# EAGLE design orienteering_clock_rev2 (EAGLE 7.3.0)
REVISION: v2.1
Assembly variants: power-LM7805, power-POLOLU, SA40-19SRWA
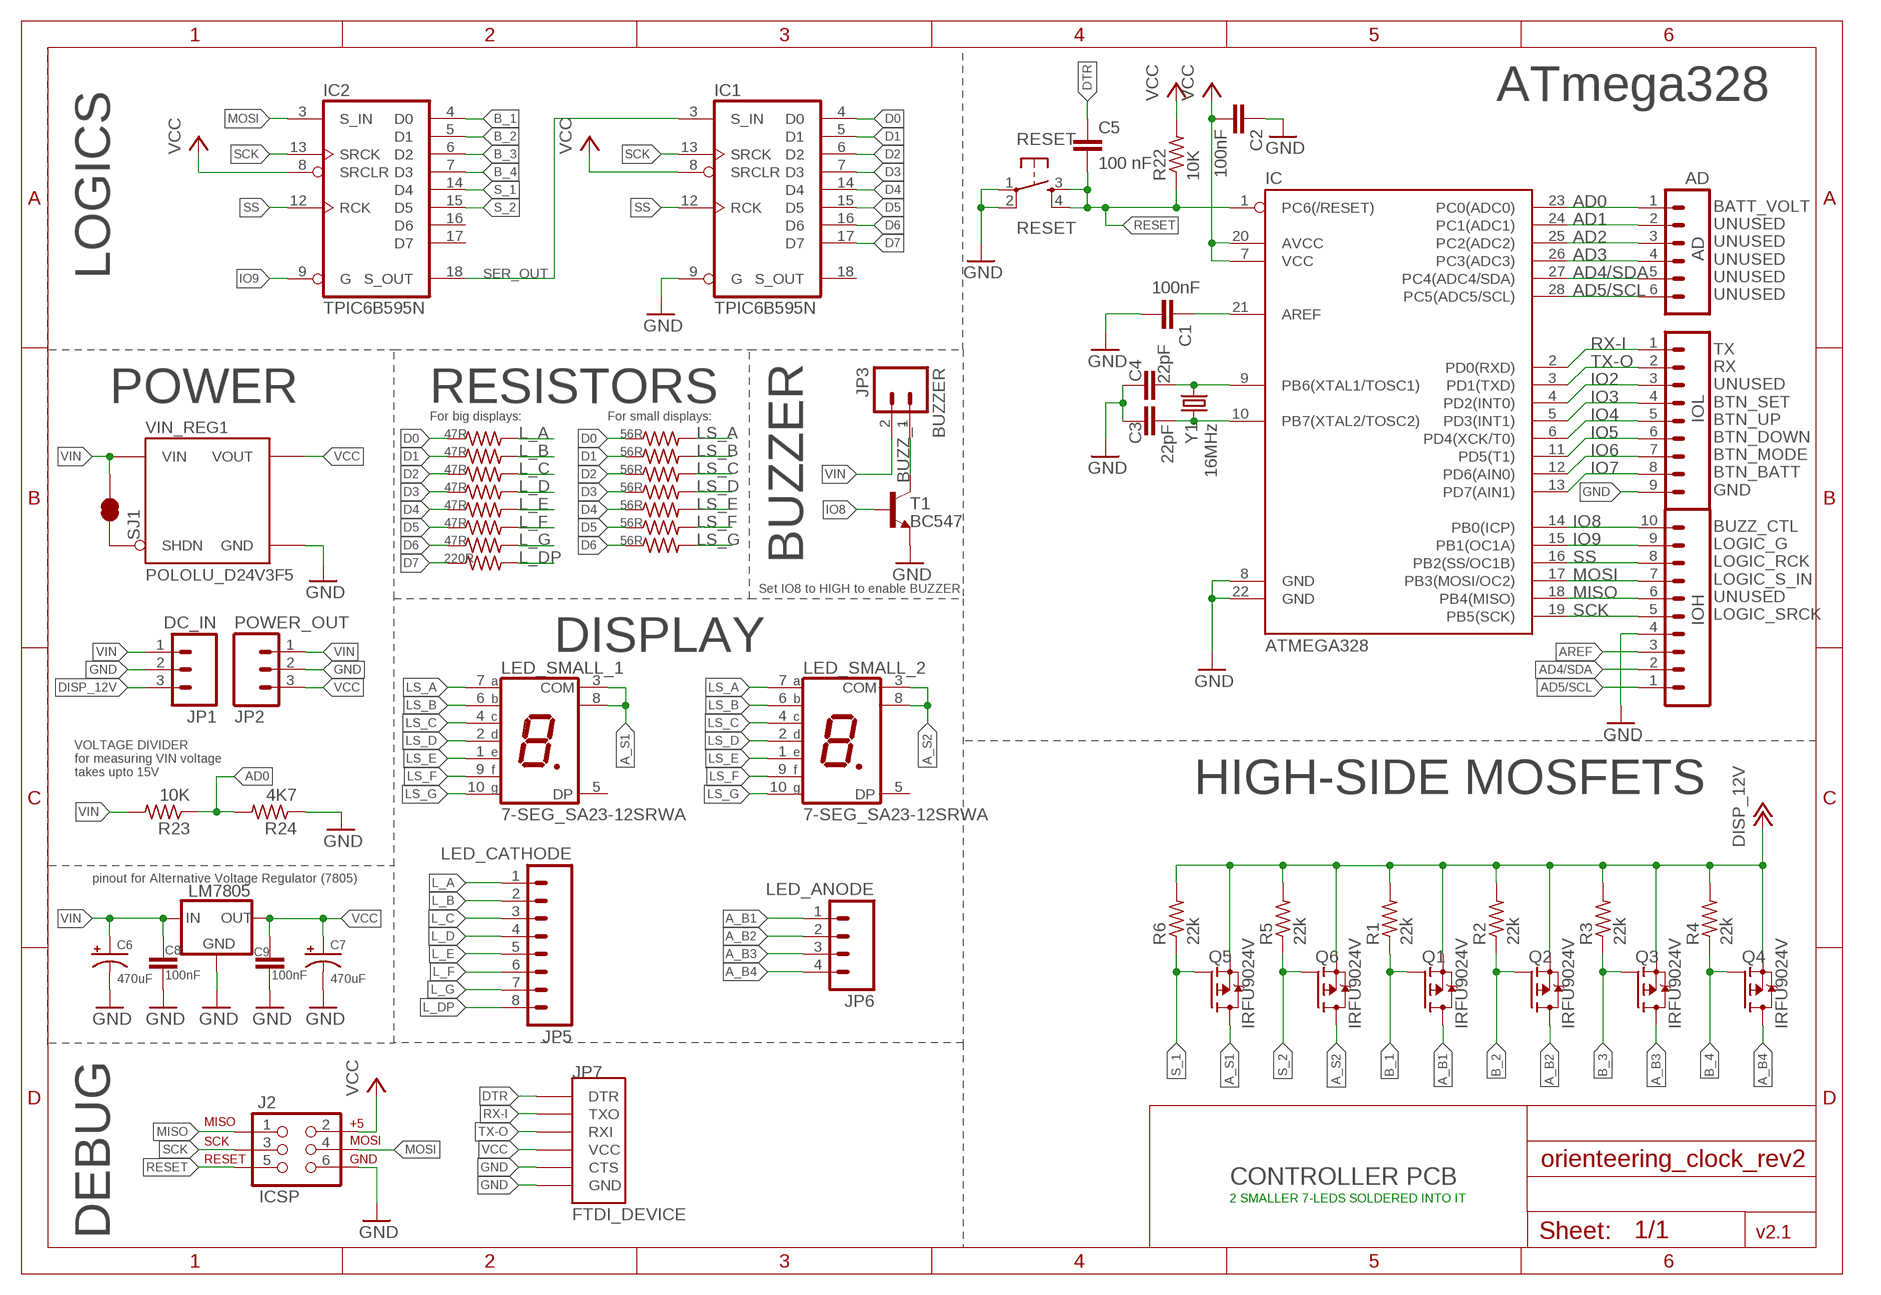
[diagram p0: schematic, sheet 1]

## Parts
AD  AD  M06SIP_LOCK  [1X06-SIP_LOCK]
C1  100nF  CAPPTH  [CAP-PTH-SMALL]
C2  100nF  CAPPTH  [CAP-PTH-SMALL]
C3  22pF  CAPPTH  [CAP-PTH-SMALL]
C4  22pF  CAPPTH  [CAP-PTH-SMALL]
C5  100 nF  CAPPTH  [CAP-PTH-SMALL]
C6  470uF  CAP_POLPTH1  [CPOL-RADIAL-100UF-25V]  (not fitted in variant power-POLOLU)  (not fitted in variant SA40-19SRWA)
C7  470uF  CAP_POLPTH1  [CPOL-RADIAL-100UF-25V]  (not fitted in variant power-POLOLU)  (not fitted in variant SA40-19SRWA)
C8  100nF  CAPPTH  [CAP-PTH-SMALL]  (not fitted in variant power-POLOLU)  (not fitted in variant SA40-19SRWA)
C9  100nF  CAPPTH  [CAP-PTH-SMALL]  (not fitted in variant power-POLOLU)  (not fitted in variant SA40-19SRWA)
IC  ATMEGA328  ATMEGA328P_PDIP  [DIL28-3]
IC1  TPIC6B595N  [DIL20]
IC2  TPIC6B595N  [DIL20]
IOH  M10LOCK  [1X10_LOCK]
IOL  M09LOCK  [1X09_LOCK]
J2  ICSP  AVR_SPI_PRG_62X3_LOCK  [2X3_LOCK]
JP1  DC_IN  M03POLAR  [MOLEX-1X3]
JP2  POWER_OUT  M03LOCK  [1X03_LOCK]
JP3  BUZZER  M02LOCK  [1X02_LOCK]
JP5  LED_CATHODE  M08  [1X08_ROUND]
JP6  LED_ANODE  M04PTH  [1X04]
JP7  FTDI_DEVICE  [FTDI_DEVICE_SIDE]
LED_SMALL_1  7-SEG_SA23-12SRWA  [SA23-12SRWA]
LED_SMALL_2  7-SEG_SA23-12SRWA  [SA23-12SRWA]
LM7805  78XXS  [78XXS]  (not fitted in variant power-POLOLU)  (not fitted in variant SA40-19SRWA)
Q1  IRFU9024V  [TO251AA-V]
Q2  IRFU9024V  [TO251AA-V]
Q3  IRFU9024V  [TO251AA-V]
Q4  IRFU9024V  [TO251AA-V]
Q5  IRFU9024V  [TO251AA-V]
Q6  IRFU9024V  [TO251AA-V]
R1  22k  R-US_0207/5V  [0207/5V]
R2  22k  R-US_0207/5V  [0207/5V]
R3  22k  R-US_0207/5V  [0207/5V]
R4  22k  R-US_0207/5V  [0207/5V]
R5  22k  R-US_0207/5V  [0207/5V]
R6  22k  R-US_0207/5V  [0207/5V]
R7  47R  R-US_0207/10  [0207/10]  (variant SA40-19SRWA: 22R/1W)
R8  47R  R-US_0207/10  [0207/10]  (variant SA40-19SRWA: 22R/1W)
R9  47R  R-US_0207/10  [0207/10]  (variant SA40-19SRWA: 22R/1W)
R10  47R  R-US_0207/10  [0207/10]  (variant SA40-19SRWA: 22R/1W)
R11  47R  R-US_0207/10  [0207/10]  (variant SA40-19SRWA: 22R/1W)
R12  47R  R-US_0207/10  [0207/10]  (variant SA40-19SRWA: 22R/1W)
R13  47R  R-US_0207/10  [0207/10]  (variant SA40-19SRWA: 22R/1W)
R14  56R  R-US_0207/10  [0207/10]
R15  56R  R-US_0207/10  [0207/10]
R16  56R  R-US_0207/10  [0207/10]
R17  56R  R-US_0207/10  [0207/10]
R18  56R  R-US_0207/10  [0207/10]
R19  56R  R-US_0207/10  [0207/10]
R20  56R  R-US_0207/10  [0207/10]
R21  220R  R-US_0207/10  [0207/10]
R22  10K  R-US_0207/10  [0207/10]
R23  10K  R-US_0207/10  [0207/10]
R24  4K7  R-US_0207/10  [0207/10]
RESET  RESET  TAC_SWITCHPTH  [TACTILE-PTH]
SJ1  SHDN_PULLUP  JUMPER-PAD-2-NC_BY_TRACE  [PAD-JUMPER-2-NC_BY_TRACE_YES_SILK]  (not fitted in variant power-LM7805)
T1  BC547  [TO92]
VIN_REG1  POLOLU_D24V3F5  POLOLU_D24V3F5-HC  [POLOLU_D24V3F_HC]  (not fitted in variant power-LM7805)
Y1  16MHz  CRYSTALHC49US  [HC49US]

## Nets
A_B1 [power]: JP6.1 Q1.2(D)
A_B2 [power]: JP6.2 Q2.2(D)
A_B3 [power]: JP6.3 Q3.2(D)
A_B4 [power]: JP6.4 Q4.2(D)
A_S1 [power]: LED_SMALL_1.3(COM) LED_SMALL_1.8(COM) Q5.2(D)
A_S2 [power]: LED_SMALL_2.3(COM) LED_SMALL_2.8(COM) Q6.2(D)
AD0 [SPI]: AD.1 IC.23(PC0(ADC0)) R23.1 R24.2
AD1 [SPI]: AD.2 IC.24(PC1(ADC1))
AD2 [SPI]: AD.3 IC.25(PC2(ADC2))
AD3 [SPI]: AD.4 IC.26(PC3(ADC3))
AD4/SDA [SPI]: AD.5 IC.27(PC4(ADC4/SDA)) IOH.2
AD5/SCL [SPI]: AD.6 IC.28(PC5(ADC5/SCL)) IOH.1
AREF [SPI]: C1.1 IC.21(AREF) IOH.3
B_1: IC2.4(D0) Q1.1(G) R1.1
B_2: IC2.5(D1) Q2.1(G) R2.1
B_3: IC2.6(D2) Q3.1(G) R3.1
B_4: IC2.7(D3) Q4.1(G) R4.1
BUZZ_- [SPI]: JP3.1 T1.3(C)
D0: IC1.4(D0) R7.1 R14.1
D1: IC1.5(D1) R8.1 R15.1
D2: IC1.6(D2) R9.1 R16.1
D3: IC1.7(D3) R10.1 R17.1
D4: IC1.14(D4) R11.1 R18.1
D5: IC1.15(D5) R12.1 R19.1
D6: IC1.16(D6) R13.1 R20.1
D7: IC1.17(D7) R21.1
DISP_12V [power]: JP1.3 Q1.3(S) Q2.3(S) Q3.3(S) Q4.3(S) Q5.3(S) Q6.3(S) R1.2 R2.2 R3.2 R4.2 R5.2 R6.2
DTR: C5.1 JP7.P$1(DTR)
GND [GND]: C1.2 C2.1 C3.1 C4.1 C6.2(-) C7.2(-) C8.2 C9.2 IC1.9(G) IC.8(GND) IC.22(GND) IOH.4 IOL.9 J2.6 JP1.2 JP2.2 JP7.P$5(CTS) JP7.P$6(GND) LM7805.GND R24.1 RESET.1 RESET.2 T1.1(E) VIN_REG1.G(GND)
IO2: IC.4(PD2(INT0)) IOL.3
IO3: IC.5(PD3(INT1)) IOL.4
IO4: IC.6(PD4(XCK/T0)) IOL.5
IO5: IC.11(PD5(T1)) IOL.6
IO6: IC.12(PD6(AIN0)) IOL.7
IO7: IC.13(PD7(AIN1)) IOL.8
IO8: IC.14(PB0(ICP)) IOH.10 T1.2(B)
IO9: IC2.9(G) IC.15(PB1(OC1A)) IOH.9
L_A: JP5.1 R7.2
L_B: JP5.2 R8.2
L_C: JP5.3 R9.2
L_D: JP5.4 R10.2
L_DP: JP5.8 R21.2
L_E: JP5.5 R11.2
L_F: JP5.6 R12.2
L_G: JP5.7 R13.2
LS_A: LED_SMALL_1.7(A) LED_SMALL_2.7(A) R14.2
LS_B: LED_SMALL_1.6(B) LED_SMALL_2.6(B) R15.2
LS_C: LED_SMALL_1.4(C) LED_SMALL_2.4(C) R16.2
LS_D: LED_SMALL_1.2(D) LED_SMALL_2.2(D) R17.2
LS_E: LED_SMALL_1.1(E) LED_SMALL_2.1(E) R18.2
LS_F: LED_SMALL_1.9(F) LED_SMALL_2.9(F) R19.2
LS_G: LED_SMALL_1.10(G) LED_SMALL_2.10(G) R20.2
MISO [SPI]: IC.18(PB4(MISO)) IOH.6 J2.1
MOSI [SPI]: IC2.3(S_IN) IC.17(PB3(MOSI/OC2)) IOH.7 J2.4
N$1 [SPI]: SJ1.2 VIN_REG1.S(SHDN)
N$5: C4.2 IC.9(PB6(XTAL1/TOSC1)) Y1.2
N$6: C3.2 IC.10(PB7(XTAL2/TOSC2)) Y1.1
RESET: C5.2 IC.1(PC6(/RESET)) J2.5 R22.1 RESET.3 RESET.4
RX-I: IC.2(PD0(RXD)) IOL.1 JP7.P$2(TXO)
S_1: IC2.14(D4) Q5.1(G) R6.1
S_2: IC2.15(D5) Q6.1(G) R5.1
SCK [SPI]: IC1.13(SRCK) IC2.13(SRCK) IC.19(PB5(SCK)) IOH.5 J2.3
SER_OUT: IC1.3(S_IN) IC2.18(S_OUT)
SS: IC1.12(RCK) IC2.12(RCK) IC.16(PB2(SS/OC1B)) IOH.8
TX-O: IC.3(PD1(TXD)) IOL.2 JP7.P$3(RXI)
VCC [SPI]: C2.2 C7.1(+) C9.1 IC1.8(SRCLR) IC2.8(SRCLR) IC.7(VCC) IC.20(AVCC) J2.2 JP2.3 JP7.P$4(VCC) LM7805.OUT R22.2 VIN_REG1.O(VOUT)
VIN [power]: C6.1(+) C8.1 JP1.1 JP2.1 JP3.2 LM7805.IN R23.2 SJ1.1 VIN_REG1.I(VIN)
Unconnected: IC1.18(S_OUT) IC2.16(D6) IC2.17(D7) LED_SMALL_1.5(DP) LED_SMALL_2.5(DP)

## Notes on the sheet
- ATmega328
- LOGICS
- BATT_VOLT
  UNUSED
  UNUSED
  UNUSED
  UNUSED
  UNUSED
- POWER | RESISTORS
- For big displays: | For small displays:
- TX
  RX
  UNUSED
  BTN_SET
  BTN_UP
  BTN_DOWN
  BTN_MODE
  BTN_BATT
  GND
- BUZZER
- Set IO8 to HIGH to enable BUZZER
- BUZZ_CTL
  LOGIC_G
  LOGIC_RCK
  LOGIC_S_IN
  UNUSED
  LOGIC_SRCK
- DISPLAY
- VOLTAGE DIVIDER
  for measuring VIN voltage
  takes upto 15V
- HIGH-SIDE MOSFETS
- pinout for Alternative Voltage Regulator (7805)
- CONTROLLER PCB
- 2 SMALLER 7-LEDS SOLDERED INTO IT
- DEBUG

## Power pins joined to a net without a drawn wire
GND: IC1.10(GND) IC1.11(GND) IC1.19(GND) IC2.10(GND) IC2.11(GND) IC2.19(GND)
VCC: IC1.2(VCC) IC2.2(VCC)

## Library data of the parts
AD = SparkFun:M06: Header 6 Standard 6-pin 0.1" header. Use with straight break away headers (SKU : PRT-00116), right angle break away headers (PRT-00553), swiss pins (PRT-00743), machine pins (PRT-00117), and female headers (PRT-00115). Molex polarized connector foot print use with SKU : PRT-08094 with associated crimp pins and housings. NOTES ON THE VARIANTS LOCK and LOCK_LONGPADS... This footprint was designed to help hold the alignment of a through-hole component (i.e. 6-pin header) while soldering it into place. You may notice that each hole has been shifted either up or down by 0.005 of an inch from it's more standard position (which is a perfectly straight line). This slight alteration caused the pins (the squares in the middle) to touch the edges of the holes. Because they are alternating, it causes a "brace" to hold the component in place. 0.005 has proven to be the perfect amount of "off-center" position when using our standard breakaway headers. Although looks a little odd when you look at the bare footprint, once you have a header in there, the alteration is very hard to notice. Also, if you push a header all the way into place, it is covered up entirely on the bottom side. This idea of altering the position of holes to aid alignment will be further integrated into the Sparkfun Library for other footprints. It can help hold any component with 3 or more connection pins.
C1 C2 C5 = SparkFun:CAP: Capacitor Standard 0603 ceramic capacitor, and 0.1" leaded capacitor.
C3 C4 = SparkFun-Capacitors:CAP: Capacitor Standard 0603 ceramic capacitor, and 0.1" leaded capacitor.
C6 C7 = SparkFun-Passives:CAP_POL: Capacitor Polarized These are standard SMD and PTH capacitors. Normally 10uF, 47uF, and 100uF in electrolytic and tantalum varieties. Always verify the external diameter of the through hole cap, it varies with capacity, voltage, and manufacturer. The EIA devices should be standard.
C8 C9 = SparkFun-Passives:CAP: Capacitor Standard 0603 ceramic capacitor, and 0.1" leaded capacitor.
IC = SparkFun-DigitalIC:ATMEGA328P_PDIP: uC used in the Arduino 32kb flash, 1k EEPROM, 2k SRAM This is the through-hole version of this chip.
IC1 IC2 = NumericDisplay:TPIC6B595: 8-bit SHIFT REGISTER, output latch
IOH = SparkFun-Connectors:M10: Header 10 Standard 10-pin 0.1" header. Use with straight break away headers (SKU : PRT-00116), right angle break away headers (PRT-00553), swiss pins (PRT-00743), machine pins (PRT-00117), and female headers (PRT-00115).
IOL = SparkFun-Connectors:M09: Header 9 Standard 9-pin 0.1" header. Use with straight break away headers (SKU : PRT-00116), right angle break away headers (PRT-00553), swiss pins (PRT-00743), machine pins (PRT-00117), and female headers (PRT-00115).
J2 = SparkFun-Connectors:AVR_SPI_PRG_6: AVR ISP 6 Pin This is the reduced ISP connector for AVR programming. Common on Arduino. This footprint will take up less PCB space and can be used with a 10-pin to 6-pin adapter such as SKU: BOB-08508 **Special note about "TEST_POINT" package. The stop mask is on the top side, so if you want your programming test points to be on the bottom of your board, make sure to place this package on the bottom side of the board. This also ensure that the orientation to program from the bottom side will be correct.
JP1 JP2 = SparkFun-Connectors:M03: Header 3 Standard 3-pin 0.1" header. Use with straight break away headers (SKU : PRT-00116), right angle break away headers (PRT-00553), swiss pins (PRT-00743), machine pins (PRT-00117), and female headers (PRT-00115). Molex polarized connector foot print use with SKU : PRT-08232 with associated crimp pins and housings.
JP3 = SparkFun-Connectors:M02: Standard 2-pin 0.1" header. Use with - straight break away headers ( PRT-00116) - right angle break away headers (PRT-00553) - swiss pins (PRT-00743) - machine pins (PRT-00117) - female headers (PRT-00115) Molex polarized connector foot print use with: PRT-08233 with associated crimp pins and housings. 2.54_SCREWTERM for use with PRT-10571. 3.5mm Screw Terminal footprints for PRT-08084 5mm Screw Terminal footprints for use with PRT-08432
JP5 = SparkFun-Connectors:M08: Header 8 Standard 8-pin 0.1" header. Use with straight break away headers (SKU : PRT-00116), right angle break away headers (PRT-00553), swiss pins (PRT-00743), machine pins (PRT-00117), and female headers (PRT-00115).
JP6 = SparkFun-Connectors:M04: Header 4 Standard 4-pin 0.1" header. Use with straight break away headers (SKU : PRT-00116), right angle break away headers (PRT-00553), swiss pins (PRT-00743), machine pins (PRT-00117), and female headers (PRT-00115). Molex polarized connector foot print use with SKU : PRT-08231 with associated crimp pins and housings. 1MM SMD Version SKU: PRT-10208
JP7 = SparkFun-Connectors:FTDI_DEVICE: Connector which mates to FTDI basic or FTDI cable.
LED_SMALL_1 LED_SMALL_2 = MINE:7-SEG_: Kingbright 14.2mm (0.56 INCH) SINGLE DIGIT NUMERIC DUISPLAY Source: SA56-11EWA(Ver1189471036.pdf
LM7805 = MINE:78XXS: VOLTAGE REGULATOR - NO DRILL
Q1-Q6 = MINE:IRFU9024: P-CHANNEL MOSFET
R1-R24 = resistor:R-US_: RESISTOR, American symbol
RESET = SparkFun:TAC_SWITCH: Momentary Switch Button commonly used for reset or general input. Spark Fun Electronics SKU : COM-00097
SJ1 = SparkFun-Passives:JUMPER-PAD-2-NC_BY_TRACE
T1 = transistor:BC547: NPN TRANSISTOR
VIN_REG1 = _hhn_Pololu:POLOLU_D24V3F*: Pololu Step Down Voltage Regulators Series D24V3F_ (300 mA) 0.4"x0.5" SOURCE www.pololu.com/ PACKAGE THT; 4-pin (0.1"); 0.4"x0.5" TECHNOLOGIES D24V3F… Vo/V Vi/V (for max. Io) X: (generic) 3: 3.3 3.8 ( 4.3) … 42.0 5: 5.0 6.0 ( 6.5) … 42.0 9: 9.0 10.5 (12.5) … 42.0 12: 12.0 14.0 (17.5) … 42.0 Io: 300 mA; Quiescent Current: 2 mA (SHDN: 20 uA) Author: Dipl.-Ing. FH Rainer Bayer
Y1 = SparkFun-FreqCtrl:CRYSTAL: Various standard crystals. Proven footprints.

## Net classes
0 default: width 0.305 mm, drill 0.305 mm, clearance 0.305 mm
1 power: width 0.813 mm, drill 0.61 mm, clearance 0.406 mm
2 GND: width 0.813 mm, drill 0.61 mm, clearance 0.406 mm
3 SPI: width 0.406 mm, clearance 0.305 mm

## Board
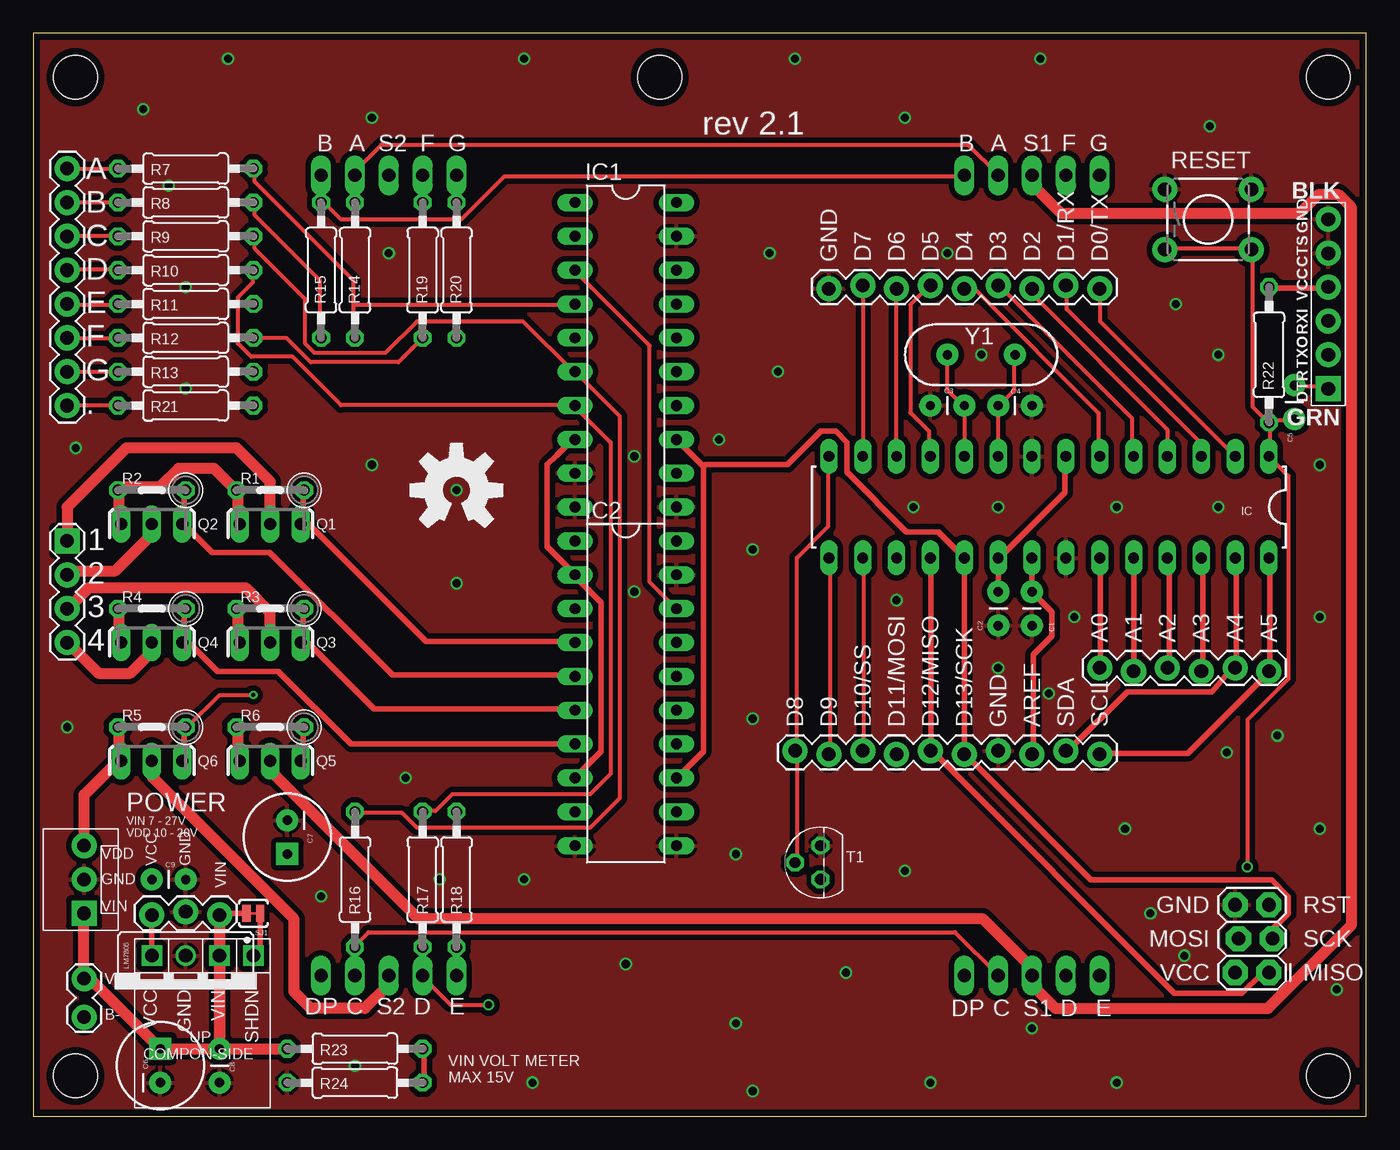
[diagram p1: board, top side]
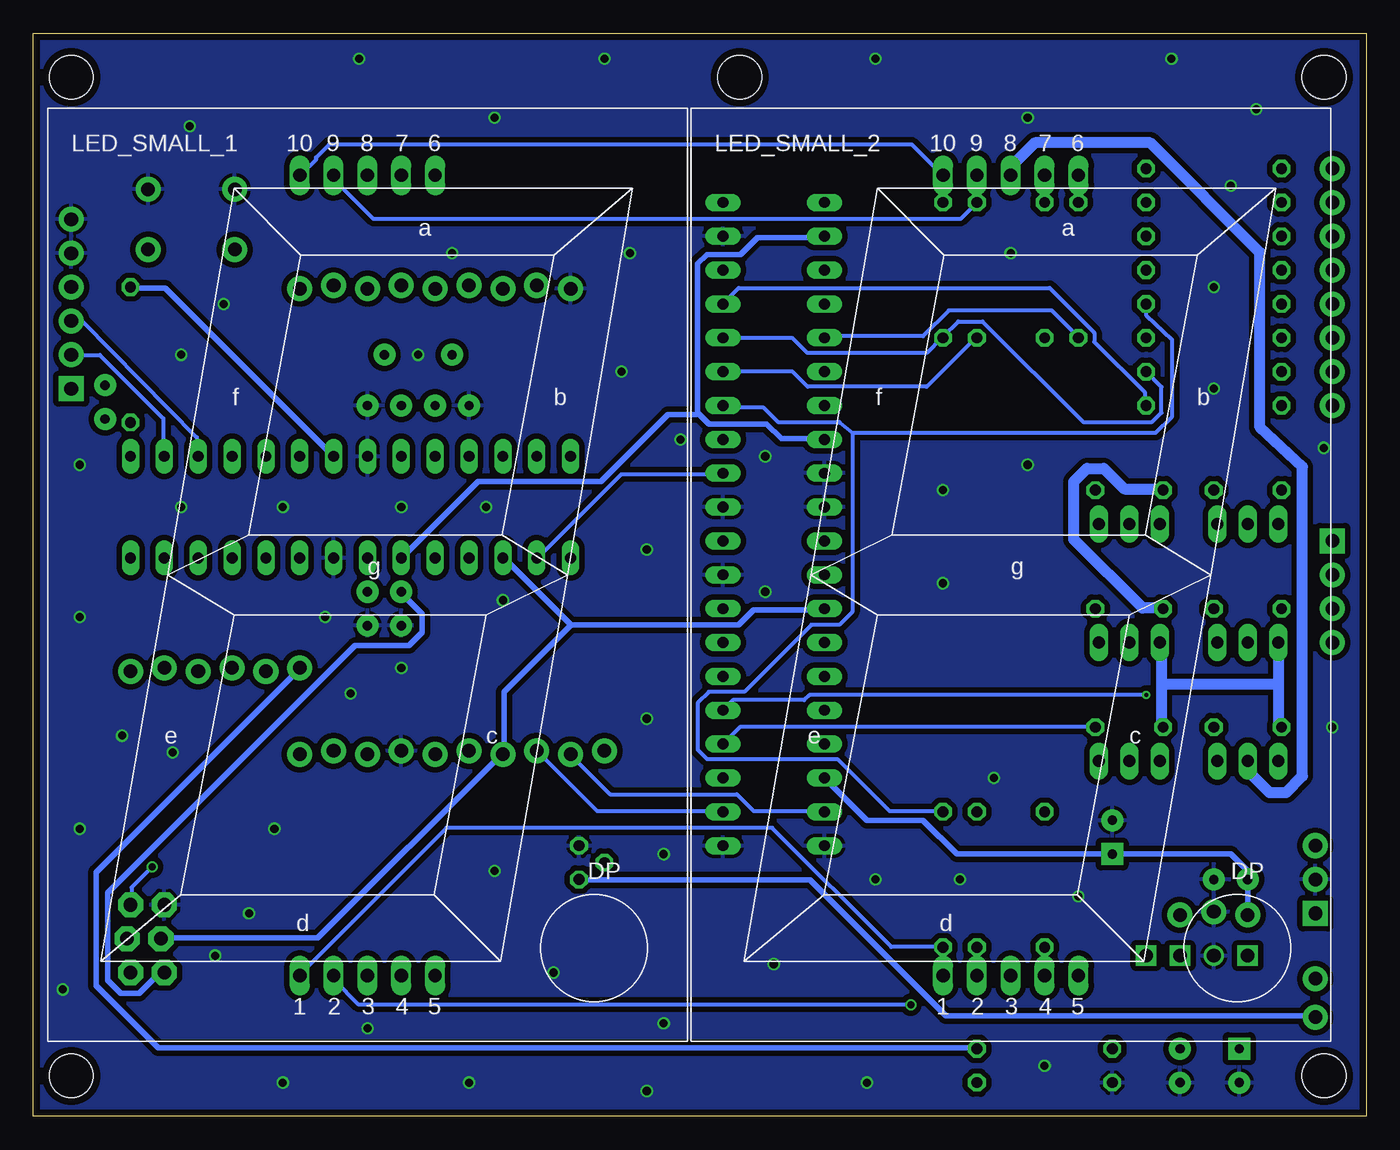
[diagram p2: board, bottom side, seen from below]

Size 100 x 81.27 mm. Coordinates in mm from the lower left corner, seen from the top.
Outline: 0,0 100,0 100,81.27 0,81.27 0,0
Copper layers (1*16): Top 0.035mm / dielectric 1.5mm / Bottom 0.035mm
Design rules "smart-prototyping_EagleRules": minimum track width 7mil, minimum drill 12mil, track to track 7mil, track to pad 7mil, pad to pad 7mil, via to via 7mil, smd to smd 0mil, copper to edge 20mil, drill to drill 10mil, minimum pad ring 10mil, minimum via ring 6mil, stop-mask expansion 2mil, vias tented up to drill 25mil, thermal gap 10mil

### Footprints (pad centres in the part's own frame; a part is rotated, then mirrored left to right if it is on the bottom)
1X06-SIP_LOCK = drill 1.016 pad 1.88: 1 0,0; 2 2.54,-0.254; 3 5.08,0; 4 7.62,-0.254; 5 10.16,0; 6 12.7,-0.254
CAP-PTH-SMALL = drill 0.7 pad 1.651: 1 0,0; 2 2.54,0
CPOL-RADIAL-100UF-25V = drill 0.7 pad 1.651 square: 1 1.27,0 | drill 0.7 pad 1.651: 2 -1.27,0
DIL28-3 = drill 0.813 long: 1 -16.51,-3.81; 2 -13.97,-3.81; 3 -11.43,-3.81; 4 -8.89,-3.81; 5 -6.35,-3.81; 6 -3.81,-3.81; 7 -1.27,-3.81; 8 1.27,-3.81; 9 3.81,-3.81; 10 6.35,-3.81; 11 8.89,-3.81; 12 11.43,-3.81; 13 13.97,-3.81; 14 16.51,-3.81; 15 16.51,3.81; 16 13.97,3.81; 17 11.43,3.81; 18 8.89,3.81; 19 6.35,3.81; 20 3.81,3.81; 21 1.27,3.81; 22 -1.27,3.81; 23 -3.81,3.81; 24 -6.35,3.81; 25 -8.89,3.81; 26 -11.43,3.81; 27 -13.97,3.81; 28 -16.51,3.81
DIL20 = drill 0.813 long: 1 -11.43,-3.81; 2 -8.89,-3.81; 3 -6.35,-3.81; 4 -3.81,-3.81; 5 -1.27,-3.81; 6 1.27,-3.81; 7 3.81,-3.81; 8 6.35,-3.81; 9 8.89,-3.81; 10 11.43,-3.81; 11 11.43,3.81; 12 8.89,3.81; 13 6.35,3.81; 14 3.81,3.81; 15 1.27,3.81; 16 -1.27,3.81; 17 -3.81,3.81; 18 -6.35,3.81; 19 -8.89,3.81; 20 -11.43,3.81
1X10_LOCK = drill 1.016 pad 1.88: 1 0,0.127; 2 2.54,-0.127; 3 5.08,0.127; 4 7.62,-0.127; 5 10.16,0.127; 6 12.7,-0.127; 7 15.24,0.127; 8 17.78,-0.127; 9 20.32,0.127; 10 22.86,-0.127
1X09_LOCK = drill 1.016 pad 1.88: 1 0,0.127; 2 2.54,-0.127; 3 5.08,0.127; 4 7.62,-0.127; 5 10.16,0.127; 6 12.7,-0.127; 7 15.24,0.127; 8 17.78,-0.127; 9 20.32,0.127
2X3_LOCK = drill 1.016 pad 1.88 octagon: 1 0,0; 2 0,2.54; 3 2.54,-0.254; 4 2.54,2.286; 5 5.08,0; 6 5.08,2.54
MOLEX-1X3 = drill 1.016 pad 1.88 square: 1 0,0 | drill 1.016 pad 1.88: 2 2.54,0; 3 5.08,0
1X03_LOCK = drill 1.016 pad 1.88: 1 0,0.127; 2 2.54,-0.127; 3 5.08,0.127
1X02_LOCK = drill 1.016 pad 1.88: 1 -0.178,0; 2 2.718,0
STAND-OFF = hole 3.302: 0,0
1X08_ROUND = drill 1.016 pad 1.88: 1 0,0; 2 2.54,0; 3 5.08,0; 4 7.62,0; 5 10.16,0; 6 12.7,0; 7 15.24,0; 8 17.78,0
1X04 = drill 1.016 pad 1.88 square: 1 0,0 | drill 1.016 pad 1.88: 2 2.54,0; 3 5.08,0; 4 7.62,0
FTDI_DEVICE_SIDE = drill 1.016 pad 1.88 square: P$1 -6.35,0 | drill 1.016 pad 1.88: P$2 -3.81,0; P$3 -1.27,0; P$4 1.27,0; P$5 3.81,0; P$6 6.35,0
SA23-12SRWA = drill 1 long: 1 -5.08,-30.08; 2 -2.54,-30.08; 3 0,-30.08; 4 2.54,-30.08; 5 5.08,-30.08; 6 5.08,29.98; 7 2.54,29.98; 8 0,29.98; 9 -2.54,29.98; 10 -5.08,29.98
78XXS = smd 0.61 x 0.305: GND 0,-2.54; IN -2.54,-2.54; OUT 2.54,-2.54
TO251AA-V = drill 0.889 long: 1 -2.286,0; 2 0,0; 3 2.286,0
0207/5V = drill 0.813 octagon: 1 -2.54,0; 2 2.54,0
0207/10 = drill 0.813 octagon: 1 -5.08,0; 2 5.08,0
TACTILE-PTH = drill 1.016 pad 1.88: 1 -3.251,2.261; 2 3.251,2.261; 3 -3.251,-2.261; 4 3.251,-2.261
PAD-JUMPER-2-NC_BY_TRACE_YES_SILK = smd 0.635 x 1.27: 1 -0.508,0; 2 0.508,0
TO92 = drill 0.813 octagon: 1 1.27,0; 2 0,1.905; 3 -1.27,0
POLOLU_D24V3F_HC = drill 1.016: G 1.27,-5.715 | drill 1.016 square: I -1.27,-5.715; O 3.81,-5.715; S -3.81,-5.715
HC49US = drill 0.7 pad 1.651: 1 -2.54,0; 2 2.54,0

### Placement (x,y rotation side)
AD  80.01,33.66 0 top
C1  74.93,39.37 270 top
C2  72.39,36.83 90 top
C3  67.31,53.34 0 top
C4  74.93,53.34 180 top
C5  94.61,54.86 270 top
C6  9.53,3.81 90 top  (not fitted)
C7  19.05,20.95 270 top  (not fitted)
C8  13.97,5.08 270 top  (not fitted)
C9  8.89,17.78 0 top  (not fitted)
E$1  [OSHW-LOGO-L]  31.75,46.99 0 top
E$2  [DARWINIA-LOGO]  31.75,38.73 0 top
IC  76.2,45.72 180 top
IC1  44.45,57.15 270 top
IC2  44.45,31.75 270 top
IOH  80.01,27.3 180 top
IOL  80.01,62.23 180 top
J2  92.71,10.79 90 top
JP1  3.81,15.24 90 top
JP2  13.97,15.24 180 top
JP3  3.81,7.62 90 top
JP4  STAND-OFF  [STAND-OFF]  3.17,77.98 0 top
JP5  2.54,71.12 270 top
JP6  2.54,43.18 270 top
JP7  97.16,60.96 90 top
JP8  STAND-OFF  [STAND-OFF]  3.17,3.05 0 top
JP9  STAND-OFF  [STAND-OFF]  97.16,3.05 0 top
JP10  STAND-OFF  [STAND-OFF]  97.16,77.98 0 top
JP11  STAND-OFF  [STAND-OFF]  47,77.98 0 top
LED_SMALL_1  74.93,40.64 0 bottom
LED_SMALL_2  26.67,40.64 0 bottom
LM7805  11.43,9.53 180 top  (not fitted)
Q1  17.78,44.45 180 top
Q2  8.89,44.45 180 top
Q3  17.78,35.56 180 top
Q4  8.89,35.56 180 top
Q5  17.78,26.67 180 top
Q6  8.89,26.67 180 top
R1  17.78,46.99 180 top
R2  8.89,46.99 180 top
R3  17.78,38.1 180 top
R4  8.89,38.1 180 top
R5  8.89,29.21 180 top
R6  17.78,29.21 180 top
R7  22R/1W  [0207/10]  11.43,71.12 180 top
R8  22R/1W  [0207/10]  11.43,68.58 180 top
R9  22R/1W  [0207/10]  11.43,66.04 180 top
R10  22R/1W  [0207/10]  11.43,63.5 180 top
R11  22R/1W  [0207/10]  11.43,60.96 180 top
R12  22R/1W  [0207/10]  11.43,58.42 180 top
R13  22R/1W  [0207/10]  11.43,55.88 180 top
R14  24.13,63.5 90 top
R15  21.59,63.5 90 top
R16  24.13,17.78 270 top
R17  29.21,17.78 270 top
R18  31.75,17.78 270 top
R19  29.21,63.5 90 top
R20  31.75,63.5 90 top
R21  11.43,53.34 180 top
R22  92.71,57.15 90 top
R23  24.13,5.08 180 top
R24  24.13,2.54 0 top
RESET  88.14,67.31 0 top
SJ1  16.51,15.24 0 top
T1  59.05,19.05 90 top
VIN_REG1  12.7,6.35 180 top
Y1  71.12,57.15 0 top

### Tracks (layer width: path | path; a pad name or v marks a point on that pad's centre or on a via)
A_B1
  Top 0.813: Q1.2 17.78,47.62 15.24,50.16 6.99,50.16 2.54,45.72 JP6.1
A_B2
  Top 0.813: Q2.2 8.8,44.42 8.8,43.59 6.15,40.93 2.93,40.93 2.65,40.65 JP6.2
A_B3
  Top 0.813: Q3.2 17.74,35.62 17.74,37.86 15.93,39.67 4.19,39.67 2.65,38.14 JP6.3
A_B4
  Top 0.813: Q4.2 8.8,35.48 8.8,34.78 7.26,33.25 4.89,33.25 2.65,35.48 JP6.4
A_S1
  Top 0.813: Q5.2 17.88,26.54 17.88,25.84 28.92,14.81 71.25,14.81 74.88,11.18 74.88,10.62 LED_SMALL_1.3 75.02,10.2 75.02,9.78 76.69,8.1 92.62,8.1 98.91,14.39 98.91,68.17 97.93,69.15 96.39,69.15 95,67.75 77.11,67.75 75.02,69.85 75.02,70.55 LED_SMALL_1.8
A_S2
  Top 0.813: Q6.2 8.94,26.54 8.94,25.43 19.56,14.81 19.56,9.36 20.82,8.1 24.87,8.1 26.54,9.78 26.54,10.48 LED_SMALL_2.3
  Bottom 0.813: LED_SMALL_2.8 26.54,70.69 26.54,71.39 24.87,73.06 16.2,73.06 7.96,64.82 7.96,51.69 4.78,48.73 4.78,25.54 6.01,24.31 7.26,24.31 8.8,25.84 8.8,26.54 Q6.2
AD0
  Top 0.406: R24.2 29.34,2.65 29.34,5.03 R23.1 | IC.23 80.05,41.91 80.05,33.67 AD.1
  Bottom 0.406: R23.1 29.34,5.17 90.61,5.17 95.26,9.82 95.26,18.31 80.05,33.53 AD.1
AD1
  Top 0.406: IC.24 82.56,41.91 82.56,33.53 AD.2
AD2
  Top 0.406: IC.25 85.22,41.91 85.22,33.67 AD.3
AD3
  Top 0.406: IC.26 87.73,41.91 87.73,33.53 AD.4
AD4/SDA
  Top 0.406: IC.27 90.25,41.91 90.25,33.67 AD.5 89.97,33.67 88.42,31.86 82.08,31.86 77.74,27.52 77.53,27.52 IOH.2
AD5/SCL
  Top 0.406: IC.28 92.76,41.91 92.76,33.53 AD.6 92.62,33.25 86.61,27.24 80.05,27.24 IOH.1
AREF
  Top 0.406: IOH.3 75.02,27.24 75.02,34.67 76.42,36.07 76.42,37.86 75.02,39.26 C1.1 IC.21
B_1
  Top 0.305: 20.26,44.7 20.12,44.56 Q1.1 | 20.26,46.94 R1.1
  Top 0.406: 20.26,44.7 20.26,46.94 | IC2.4 40.51,35.62 29.48,35.62 20.4,44.7 Q1.1
B_2
  Top 0.305: 11.32,46.94 R2.1 | 11.18,44.56 Q2.1
  Top 0.406: 11.32,46.94 11.32,44.7 11.18,44.56 | IC2.5 40.51,33.11 26.96,33.11 17.74,42.33 13.41,42.33 11.32,44.42 Q2.1
B_3
  Top 0.305: 20.26,38 R3.1 | 20.12,35.62 Q3.1 20.4,35.76
  Top 0.406: 20.26,38 20.26,35.76 20.12,35.62 | 20.4,35.76 25.57,30.59 40.51,30.59 IC2.6
B_4
  Top 0.305: 11.32,35.76 11.18,35.62 Q4.1 | 11.32,38 R4.1
  Top 0.406: 11.32,35.76 11.32,38 | IC2.7 23.82,27.94 18.38,33.39 13.83,33.39 11.46,35.76 Q4.1
BUZZ_-
  Bottom 0.406: T1.3 58.95,17.74 41.74,17.74 31.55,7.54 3.91,7.54 JP3.1
D0
  Top 0.305: 24.03,60.91 24.03,58.53 R14.1 | 24.03,60.91 24.03,62.73 16.62,70.13 16.62,71.11 R7.1 | 24.03,60.91 40.51,60.91 IC1.4
D1
  Top 0.305: R8.1 16.62,68.45 16.62,67.61 21.51,62.73 21.51,58.53 R15.1
  Bottom 0.305: IC1.5 40.51,58.53 33.25,58.53 31.32,60.47 23.58,60.47 21.65,58.53 R15.1
D2
  Top 0.305: R16.1 24.17,22.77 27.66,22.77 28.78,21.65 41.77,21.65 43.99,23.88 43.99,52.54 40.65,55.88 IC1.6 40.51,55.88 36.74,59.65 28.78,59.65 26.4,57.28 21.09,57.28 20.4,57.98 20.4,61.33 16.62,65.1 16.62,65.94 R9.1
D3
  Top 0.305: R10.1 16.48,63.42 16.48,62.59 15.37,61.47 15.37,57.98 16.34,57 19.44,57 23.08,53.37 40.51,53.37 IC1.7 40.65,53.23 43.31,50.57 43.31,25.7 41.77,24.17 31.43,24.17 30.18,22.91 29.34,22.91 R17.1
D4
  Bottom 0.305: 38.56,51.3 39.48,52.06 39.53,52.11 44.15,52.11 45.26,53.23 48.2,53.23 IC1.14 | 38.56,51.3 15.79,51.3 14.55,52.53 14.55,58.27 16.48,60.07 16.48,60.91 R11.1 | 38.56,51.3 38.56,37.86 39.53,36.88 41.63,36.88 46.66,31.85 49.31,31.85 50.15,31.01 50.15,27.52 49.45,26.82 39.67,26.82 35.76,22.91 31.85,22.91 R18.1
D5
  Top 0.305: R12.1 16.62,58.4 19.01,58.4 20.82,56.59 27.39,56.59 29.2,58.4 R19.1
  Bottom 0.305: IC1.15 43.03,55.88 41.91,54.76 32.97,54.76 29.34,58.4 R19.1
D6
  Bottom 0.305: 16.48,55.88 R13.1 15.37,54.74 15.37,52.81 16.07,52.11 21.23,52.11 28.78,59.65 30.59,59.65 31.71,58.53 R20.1 31.85,58.4 32.97,57.28 41.91,57.28 43.03,58.4 48.2,58.4 IC1.16
D7
  Bottom 0.305: R21.1 16.62,53.37 16.62,54.34 20.4,58.12 20.4,58.81 23.75,62.17 47.08,62.17 48.2,61.05 IC1.17
DISP_12V
  Top 0.813: Q2.3 6.57,44.56 6.43,44.7 6.43,46.94 R2.2 6.71,47.22 9.5,47.22 10.9,48.62 13.55,48.62 14.95,47.22 R1.2 15.37,46.94 15.37,44.56 Q1.3 | R6.2 15.37,29.2 15.37,26.68 Q5.3 | R3.2 15.37,38 15.37,35.62 Q3.3 | R4.2 6.43,38 6.43,35.76 6.57,35.62 Q4.3 | R5.2 6.43,29.2 6.43,26.82 6.57,26.68 Q6.3 6.35,26.67 3.81,24.13 JP1.3
  Bottom 0.813: 15.37,32.41 15.37,35.48 Q3.3 | 15.37,32.41 15.37,29.34 R6.2 | 6.57,32.41 6.57,29.48 6.43,29.34 R5.2 | 6.57,32.41 6.57,35.48 Q4.3 | 6.57,32.41 15.37,32.41 | R1.2 15.37,47.08 18.16,47.08 19.7,48.62 20.95,48.62 21.93,47.64 21.93,43.31 16.76,38.14 15.37,38.14 R3.2
DTR
  Top 0.305: C5.1 94.72,54.76 96.95,54.76 97.09,54.62 JP7.P$1
GND  (via drill 0.61)
  other vias: 31.75,46.99 53.98,42.55 45.09,39.37 45.09,49.53 36.83,17.78 30.48,17.78 21.59,16.51 74.93,6.6 37.47,2.54 53.98,1.91 67.31,2.54 81.28,2.54 97.79,9.53 96.52,21.59 93.34,28.57 96.52,37.47 88.9,45.72 81.28,45.72 76.2,31.75 81.92,21.59 65.41,18.41 60.96,10.79 44.45,11.43 53.98,29.84 55.88,55.88 55.24,64.77 68.58,64.77 71.12,57.15 72.39,45.72 72.39,33.66 96.52,48.9 85.72,60.96 88.27,74.3 75.56,79.38 65.41,74.93 57.15,79.38 36.83,79.38 25.4,74.93 14.61,79.38 8.26,75.56 10.16,69.85 11.43,62.23 11.43,54.61 3.17,50.16 25.4,48.9 31.75,40.01 2.54,29.21 24.13,3.81 52.7,19.68 52.7,6.99 64.77,38.73 78.11,37.47 83.82,15.24 51.44,50.8 88.9,57.15 27.94,25.4 26.67,64.77 89.53,27.3 66.04,45.72 86.36,12.06
  pour Top (isolate 0.012): -1.91,83.82 -1.91,-1.91 102.87,-1.91 102.87,83.82
  pour Bottom (isolate 0.012): -2.54,84.45 -2.54,-2.54 103.5,-2.54 103.5,84.45
IO2
  Top 0.305: IC.4 85.08,49.59 85.08,51.55 75.02,61.61 75.02,62.03 IOL.3
IO3
  Top 0.305: IC.5 82.42,49.59 82.42,52.39 72.5,62.31 IOL.4
IO4
  Top 0.305: IC.6 79.91,49.59 79.91,52.79 70.67,62.03 69.85,62.03 IOL.5
IO5
  Top 0.305: IC.11 67.2,49.59 67.2,51.41 65.8,52.81 65.8,60.91 67.2,62.31 IOL.6
IO6
  Top 0.305: IC.12 IOL.7
IO7
  Top 0.305: IOL.8 IC.13
IO8
  Top 0.305: T1.2 57.28,19.14 57.28,27.38 IOH.10 57.28,27.52 57.28,41.91 59.65,44.28 59.65,49.45 IC.14
IO9
  Top 0.305: IC.15 59.79,41.91 59.79,27.24 IOH.9
  Bottom 0.305: IC2.9 40.65,22.91 45.96,22.91 47.22,24.17 56.72,24.17 59.65,27.1 IOH.9
L_A
  Top 0.305: R7.2 6.29,71.11 2.65,71.11 JP5.1
L_B
  Top 0.305: R8.2 6.29,68.59 2.65,68.59 JP5.2
L_C
  Top 0.305: R9.2 6.29,66.08 2.65,66.08 JP5.3
L_D
  Top 0.305: R10.2 6.29,63.56 2.65,63.56 JP5.4
L_DP
  Top 0.305: R21.2 6.29,53.37 2.65,53.37 JP5.8
L_E
  Top 0.305: R11.2 6.29,60.91 2.65,60.91 JP5.5
L_F
  Top 0.305: R12.2 6.29,58.4 2.65,58.4 JP5.6
L_G
  Top 0.305: JP5.7 R13.2
LS_A
  Top 0.305: R14.2 24.17,68.59 24.17,70.55 LED_SMALL_2.7 24.17,70.69 24.17,70.97 26.12,72.92 70.13,72.92 72.36,70.69 LED_SMALL_1.7
LS_B
  Top 0.305: LED_SMALL_2.6 21.65,70.55 21.65,68.59 R15.2 21.79,68.59 23.05,67.33 32.13,67.33 35.34,70.55 69.85,70.55 LED_SMALL_1.6
LS_C
  Top 0.305: LED_SMALL_2.4 24.17,10.62 24.17,12.57 R16.2 24.17,12.85 25.15,13.83 69.15,13.83 72.36,10.62 LED_SMALL_1.4
LS_D  (via drill 0.51)
  Top 0.305: R17.2 29.34,12.57 29.34,10.62 LED_SMALL_2.2 29.2,10.62 29.2,10.48 31.29,8.38 v34.16,8.38
  Bottom 0.305: v34.16,8.38 75.58,8.38 77.39,10.2 77.39,10.48 LED_SMALL_1.2
LS_E
  Top 0.305: R18.2 31.85,12.57 31.85,10.62 LED_SMALL_2.1
  Bottom 0.305: R18.2 31.85,12.71 35.62,12.71 44.56,21.65 69.01,21.65 80.06,10.6 LED_SMALL_1.1
LS_F
  Top 0.305: R19.2 29.34,68.59 29.34,70.55 LED_SMALL_2.9
  Bottom 0.305: R19.2 30.45,67.33 74.46,67.33 77.39,70.27 77.39,70.69 LED_SMALL_1.9
LS_G
  Top 0.305: R20.2 31.85,68.59 31.85,70.55 LED_SMALL_2.10
  Bottom 0.305: LED_SMALL_2.10 31.85,70.69 34.09,72.92 77.81,72.92 78.79,71.94 78.79,71.81 79.91,70.69 80.05,70.69 LED_SMALL_1.10
MISO
  Top 0.406: IC.18 67.33,41.91 67.33,27.52 IOH.6 67.47,27.38 85.62,9.23 90.68,9.23 92.2,10.76 92.62,10.76 J2.1
MOSI
  Bottom 0.406: 59.65,36.88 47.08,36.88 45.96,38 40.65,38 IC2.3 | 59.65,36.88 64.68,41.91 IC.17 | 59.65,36.88 64.68,31.85 64.68,27.24 IOH.7 64.96,27.1 78.65,13.41 90.39,13.41 J2.4
N$1
  Top 0.406: SJ1.2 17.02,12.57 VIN_REG1.S
N$5
  Top 0.305: Y1.2 73.62,57.14 73.62,54.48 72.5,53.37 C4.2 IC.9
N$6
  Top 0.305: IC.10 C3.2 69.71,53.37 68.59,54.48 68.59,57.14 Y1.1
RESET  (via drill 0.51)
  Top 0.305: RESET.3 84.94,65.1 91.36,65.1 RESET.4 91.5,64.96 91.5,53.23 92.62,52.11 R22.1 | R22.1 92.76,51.97 92.76,49.59 IC.1 92.76,49.45 94.16,48.06 94.16,32.83 91.08,29.76 v91.08,18.72 | C5.2 94.58,52.25 93.18,52.25 92.9,51.97 R22.1
  Bottom 0.305: v91.08,18.72 92.62,17.18 92.62,15.93 J2.5
RX-I
  Top 0.305: IC.2 80.05,59.65 80.05,62.03 IOL.1
  Bottom 0.305: IC.2 90.25,49.59 90.25,52.38 95.01,57.14 97.09,57.14 JP7.P$2
S_1
  Top 0.305: 20.12,26.68 20.26,26.82 | 20.26,29.2 R6.1
  Top 0.406: 20.26,26.82 20.26,29.2 | 20.12,26.68 Q5.1
  Bottom 0.305: IC2.14 46.99,29.21 R6.1
S_2  (via drill 0.3)
  Top 0.305: 11.32,29.2 R5.1 11.56,29.21 13.97,31.62 v16.51,31.62 | 11.18,26.68 Q6.1
  Top 0.406: 11.32,29.2 11.32,26.82 11.18,26.68
  Bottom 0.305: IC2.15 47.5,31.24 42.16,31.24 41.78,31.62 v16.51,31.62
SCK
  Top 0.406: 50.29,48.76 50.29,27.38 48.34,25.43 IC2.13 | 50.29,48.76 48.34,50.71 IC1.13 | J2.3 93.04,13.41 93.04,14.11 94.16,15.23 94.16,16.48 92.9,17.74 79.35,17.74 69.99,27.1 IOH.5 IC.19 67.89,43.87 65.52,43.87 61.05,48.34 61.05,50.57 60.21,51.41 59.09,51.41 56.58,48.9 50.43,48.9 50.29,48.76
SER_OUT
  Top 0.305: IC1.3 40.65,63.42 46.24,57.84 46.24,40.09 48.2,38.14 IC2.18
SS
  Top 0.305: IC.16 62.31,41.91 62.31,27.52 IOH.8
  Bottom 0.305: IC2.12 48.34,22.91 57.7,22.91 62.17,27.38 IOH.8 | IC1.12 48.34,48.2 55.88,48.2 62.17,41.91 IC.16
TX-O
  Top 0.305: IOL.2 77.53,62.31 77.53,60.57 87.59,50.51 87.59,49.59 IC.3
  Bottom 0.305: IC.3 87.73,49.59 87.73,50.95 96.3,59.65 97.09,59.65 JP7.P$3
VCC
  Top 0.406: R22.2 92.76,62.17 97.09,62.17 JP7.P$4 | IC.7 77.39,49.45 77.39,46.8 72.64,42.05 IC.20 C2.2 | IC2.8 40.65,25.43 42.61,27.38 42.61,38.56 40.65,40.51 IC2.2 40.51,40.79 38.56,42.75 38.56,48.9 39.26,49.59 39.27,49.59 40.39,50.71 IC1.8 | JP2.3 VIN_REG1.O
  Bottom 0.406: J2.2 90.25,10.76 90.54,10.76 92.06,9.23 93.45,9.23 94.44,10.22 94.44,16.76 75.86,35.34 71.81,35.34 70.83,36.32 70.83,37.72 72.36,39.26 C2.2 | IC.7 90.11,62.17 92.62,62.17 R22.2 | 50.15,52.81 50.15,63.98 49.45,64.68 46.94,64.68 45.68,65.94 40.65,65.94 IC1.2 | 50.15,52.81 49.31,51.97 44.98,51.97 43.87,50.85 40.65,50.85 IC1.8 | IC.20 72.36,41.91 66.64,47.64 57.42,47.64 52.39,52.67 50.29,52.67 50.15,52.81 | 8.94,15.23 JP2.3 C9.1 8.89,18.41 10.16,19.68 C7.1 30.72,19.68 33.25,22.21 37.44,22.21 40.51,25.29 IC2.8
VIN
  Top 0.406: SJ1.1 14.1,15.24 JP2.1
  Top 0.813: 3.77,10.34 JP3.2 | JP3.2 3.77,10.62 3.77,15.23 JP1.1 | C8.1 VIN_REG1.I JP2.1 C8.1 | JP3.2 4.27,10.34 C6.1 C8.1 | C8.1 R23.2

### Text on the board
tPlace: A / B / C / D / E / F / G / . | 1 / 2 / 3 / 4 | VIN 7 - 27V / VDD 10 - 20V | VIN VOLT METER / MAX 15V
tNames: B | A | S2 | F | G | rev 2.1 | B | A | S1 | F | G | GND | D7 | D6 | D5 | D4 | D3 | D2 | D1/RX | D0/TX | A0 | A1 | A2 | A3 | A4 | A5 | D8 | D9 | D10/SS | D11/MOSI | D12/MISO | D13/SCK | GND | AREF | SDA | SCL | POWER | VDD | VCC | GND | GND | VIN | GND | RST | VIN | MOSI | SCK | VCC | MISO | VIN | DP | C | S2 | D | E | DP | C | S1 | D | E | B-
tDocu: ORIENTEERING CLOCK DRIVER | NALAJCIE.ORG | For power you can either use POLOLU step-down / buck converter or LM7805 with caps